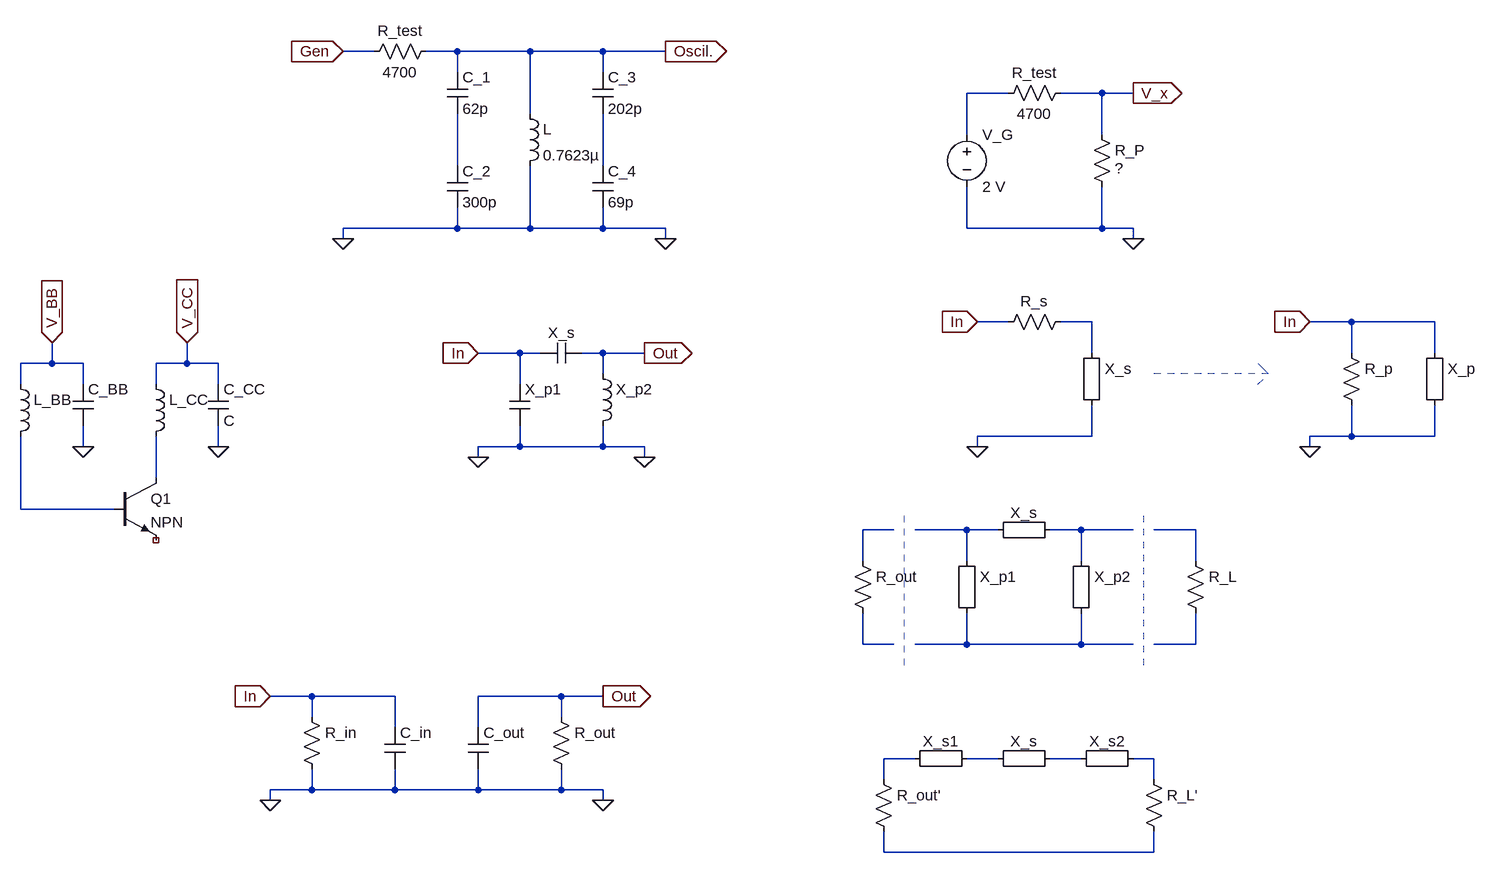
[diagram p0: schematic TP1 - Esquemáticos.asc]
TP1 - Esquemáticos.asc, the LTspice schematic file:
Version 4
SHEET 1 880 1204
WIRE -848 -32 -896 -32
WIRE -720 -32 -768 -32
WIRE -608 -32 -720 -32
WIRE -496 -32 -608 -32
WIRE -400 -32 -496 -32
WIRE -720 0 -720 -32
WIRE -496 0 -496 -32
WIRE 128 32 64 32
WIRE 272 32 208 32
WIRE 320 32 272 32
WIRE -608 64 -608 -32
WIRE 64 96 64 32
WIRE 272 96 272 32
WIRE -720 144 -720 64
WIRE -496 144 -496 64
WIRE -720 240 -720 208
WIRE -720 240 -896 240
WIRE -608 240 -608 144
WIRE -608 240 -720 240
WIRE -496 240 -496 208
WIRE -496 240 -608 240
WIRE -400 240 -496 240
WIRE 64 240 64 176
WIRE 272 240 272 176
WIRE 272 240 64 240
WIRE 320 240 272 240
WIRE -896 256 -896 240
WIRE -400 256 -400 240
WIRE 320 256 320 240
WIRE 128 384 80 384
WIRE 256 384 208 384
WIRE 656 384 592 384
WIRE 784 384 656 384
WIRE -624 432 -688 432
WIRE -592 432 -624 432
WIRE -496 432 -528 432
WIRE -432 432 -496 432
WIRE 256 432 256 384
WIRE 656 432 656 384
WIRE 784 432 784 384
WIRE -1344 448 -1344 416
WIRE -1344 448 -1392 448
WIRE -1296 448 -1344 448
WIRE -1136 448 -1136 416
WIRE -1136 448 -1184 448
WIRE -1088 448 -1136 448
WIRE -496 464 -496 432
WIRE -1392 480 -1392 448
WIRE -1296 480 -1296 448
WIRE -1184 480 -1184 448
WIRE -1088 480 -1088 448
WIRE -624 480 -624 432
WIRE 256 560 256 512
WIRE 256 560 80 560
WIRE 656 560 656 512
WIRE 656 560 592 560
WIRE 784 560 784 512
WIRE 784 560 656 560
WIRE -1296 576 -1296 544
WIRE -1088 576 -1088 544
WIRE -624 576 -624 544
WIRE -624 576 -688 576
WIRE -496 576 -496 544
WIRE -496 576 -624 576
WIRE -432 576 -496 576
WIRE 80 576 80 560
WIRE 592 576 592 560
WIRE -688 592 -688 576
WIRE -432 592 -432 576
WIRE -1184 624 -1184 560
WIRE -1392 672 -1392 560
WIRE -1248 672 -1392 672
WIRE -48 704 -96 704
WIRE 64 704 -16 704
WIRE 112 704 64 704
WIRE 240 704 192 704
WIRE 320 704 240 704
WIRE 416 704 352 704
WIRE -96 752 -96 704
WIRE 64 752 64 704
WIRE 240 752 240 704
WIRE 416 752 416 704
WIRE -96 880 -96 832
WIRE -48 880 -96 880
WIRE 64 880 64 832
WIRE 64 880 -16 880
WIRE 240 880 240 832
WIRE 240 880 64 880
WIRE 320 880 240 880
WIRE 416 880 416 832
WIRE 416 880 352 880
WIRE -944 960 -1008 960
WIRE -816 960 -944 960
WIRE -560 960 -688 960
WIRE -496 960 -560 960
WIRE -944 992 -944 960
WIRE -560 992 -560 960
WIRE -816 1008 -816 960
WIRE -688 1008 -688 960
WIRE -16 1056 -64 1056
WIRE 112 1056 64 1056
WIRE 240 1056 192 1056
WIRE 352 1056 320 1056
WIRE -64 1088 -64 1056
WIRE 352 1088 352 1056
WIRE -944 1104 -944 1072
WIRE -944 1104 -1008 1104
WIRE -816 1104 -816 1072
WIRE -816 1104 -944 1104
WIRE -688 1104 -688 1072
WIRE -688 1104 -816 1104
WIRE -560 1104 -560 1072
WIRE -560 1104 -688 1104
WIRE -496 1104 -560 1104
WIRE -1008 1120 -1008 1104
WIRE -496 1120 -496 1104
WIRE -64 1200 -64 1168
WIRE 352 1200 352 1168
WIRE 352 1200 -64 1200
FLAG 320 32 V_x
IOPIN 320 32 Out
FLAG 320 256 0
FLAG -400 256 0
FLAG -400 -32 Oscil.
IOPIN -400 -32 Out
FLAG -896 -32 Gen
IOPIN -896 -32 In
FLAG -896 256 0
FLAG 80 384 In
IOPIN 80 384 In
FLAG 592 384 In
IOPIN 592 384 In
FLAG 80 576 0
FLAG 592 576 0
FLAG -1296 576 0
FLAG -1088 576 0
FLAG -1136 416 V_CC
IOPIN -1136 416 In
FLAG -1344 416 V_BB
IOPIN -1344 416 In
FLAG -1008 960 In
IOPIN -1008 960 In
FLAG -496 960 Out
IOPIN -496 960 Out
FLAG -496 1120 0
FLAG -1008 1120 0
FLAG -688 592 0
FLAG -432 592 0
FLAG -688 432 In
IOPIN -688 432 In
FLAG -432 432 Out
IOPIN -432 432 Out
SYMBOL res 224 16 R90
WINDOW 0 0 56 VBottom 2
WINDOW 3 32 56 VTop 2
SYMATTR InstName R_test
SYMATTR Value 4700
SYMBOL res 256 80 R0
WINDOW 3 36 68 Left 2
SYMATTR Value ?
SYMATTR InstName R_P
SYMBOL voltage 64 80 R0
SYMATTR InstName V_G
SYMATTR Value 2 V
SYMBOL ind -624 48 R0
SYMATTR InstName L
SYMATTR Value 0.7623µ
SYMBOL cap -736 0 R0
SYMATTR InstName C_1
SYMATTR Value 62p
SYMBOL cap -736 144 R0
SYMATTR InstName C_2
SYMATTR Value 300p
SYMBOL cap -512 0 R0
SYMATTR InstName C_3
SYMATTR Value 202p
SYMBOL cap -512 144 R0
SYMATTR InstName C_4
SYMATTR Value 69p
SYMBOL res -752 -48 R90
WINDOW 0 0 56 VBottom 2
WINDOW 3 32 56 VTop 2
SYMATTR InstName R_test
SYMATTR Value 4700
SYMBOL res 224 368 R90
WINDOW 0 0 56 VBottom 2
WINDOW 3 32 56 VTop 2
SYMATTR InstName R_s
SYMATTR Value ""
SYMBOL res 640 416 R0
SYMATTR InstName R_p
SYMATTR Value ""
SYMBOL Misc\\EuropeanResistor 240 416 R0
SYMATTR InstName X_s
SYMATTR Value ""
SYMBOL Misc\\EuropeanResistor 768 416 R0
SYMATTR InstName X_p
SYMATTR Value ""
SYMBOL Misc\\EuropeanResistor 48 736 R0
SYMATTR InstName X_p1
SYMATTR Value ""
SYMBOL Misc\\EuropeanResistor 224 736 R0
SYMATTR InstName X_p2
SYMATTR Value ""
SYMBOL Misc\\EuropeanResistor 208 688 R90
WINDOW 0 5 56 VBottom 2
WINDOW 3 27 56 VTop 2
SYMATTR InstName X_s
SYMATTR Value ""
SYMBOL res -112 736 R0
SYMATTR InstName R_out
SYMATTR Value ""
SYMBOL res 400 736 R0
SYMATTR InstName R_L
SYMATTR Value ""
SYMBOL npn -1248 624 R0
SYMATTR InstName Q1
SYMBOL ind -1200 464 R0
SYMATTR InstName L_CC
SYMATTR Value ""
SYMBOL cap -1104 480 R0
SYMATTR InstName C_CC
SYMBOL cap -1312 480 R0
SYMATTR InstName C_BB
SYMATTR Value ""
SYMBOL ind -1408 464 R0
SYMATTR InstName L_BB
SYMATTR Value ""
SYMBOL res -960 976 R0
SYMATTR InstName R_in
SYMATTR Value ""
SYMBOL cap -832 1008 R0
SYMATTR InstName C_in
SYMATTR Value ""
SYMBOL cap -704 1008 R0
SYMATTR InstName C_out
SYMATTR Value ""
SYMBOL res -576 976 R0
SYMATTR InstName R_out
SYMATTR Value ""
SYMBOL Misc\\EuropeanResistor 80 1040 R90
WINDOW 0 5 56 VBottom 2
WINDOW 3 27 56 VTop 2
SYMATTR InstName X_s1
SYMATTR Value ""
SYMBOL Misc\\EuropeanResistor 208 1040 R90
WINDOW 0 5 56 VBottom 2
WINDOW 3 27 56 VTop 2
SYMATTR InstName X_s
SYMATTR Value ""
SYMBOL Misc\\EuropeanResistor 336 1040 R90
WINDOW 0 5 56 VBottom 2
WINDOW 3 27 56 VTop 2
SYMATTR InstName X_s2
SYMATTR Value ""
SYMBOL res -80 1072 R0
SYMATTR InstName R_out'
SYMATTR Value ""
SYMBOL res 336 1072 R0
SYMATTR InstName R_L'
SYMATTR Value ""
SYMBOL ind -512 448 R0
SYMATTR InstName X_p2
SYMATTR Value ""
SYMBOL cap -528 416 R90
WINDOW 0 0 32 VBottom 2
WINDOW 3 32 32 VTop 2
SYMATTR InstName X_s
SYMATTR Value ""
SYMBOL cap -640 480 R0
SYMATTR InstName X_p1
SYMATTR Value ""
LINE Normal 528 464 352 464 1
LINE Normal 512 448 528 464 1
LINE Normal 528 464 512 448 2
LINE Normal 512 480 528 464 1
LINE Normal -32 912 -32 672 2
LINE Normal 336 912 336 672 2

The netlist it stands for:
* TP1 - Esquemáticos.asc
R_test V_x N001 4700
R_P V_x 0 ?
V_G N001 0 2 V
L Oscil. 0 0.7623µ
C_1 Oscil. N002 62p
C_2 N002 0 300p
C_3 Oscil. N003 202p
C_4 N003 0 69p
R_test Oscil. Gen 4700
R_s N004 In
R_p In 0
R§X_s N004 0
R§X_p In 0
R§X_p1 N008 N012
R§X_p2 N009 N012
R§X_s N009 N008
R_out N007 N011
R_L N010 N013
Q1 N005 N006 NC_01 0 NPN
L_CC V_CC N005
C_CC V_CC 0 C
C_BB V_BB 0
L_BB V_BB N006
R_in In 0
C_in In 0
C_out Out 0
R_out Out 0
R§X_s1 N015 N014
R§X_s N016 N015
R§X_s2 N017 N016
R_out' N014 N018
R_L' N017 N018
L§X_p2 Out 0
C§X_s Out In
C§X_p1 In 0
.model NPN NPN
.model PNP PNP
.lib standard.bjt
.backanno
.end